# EAGLE design dnc (EAGLE 7.1.0)
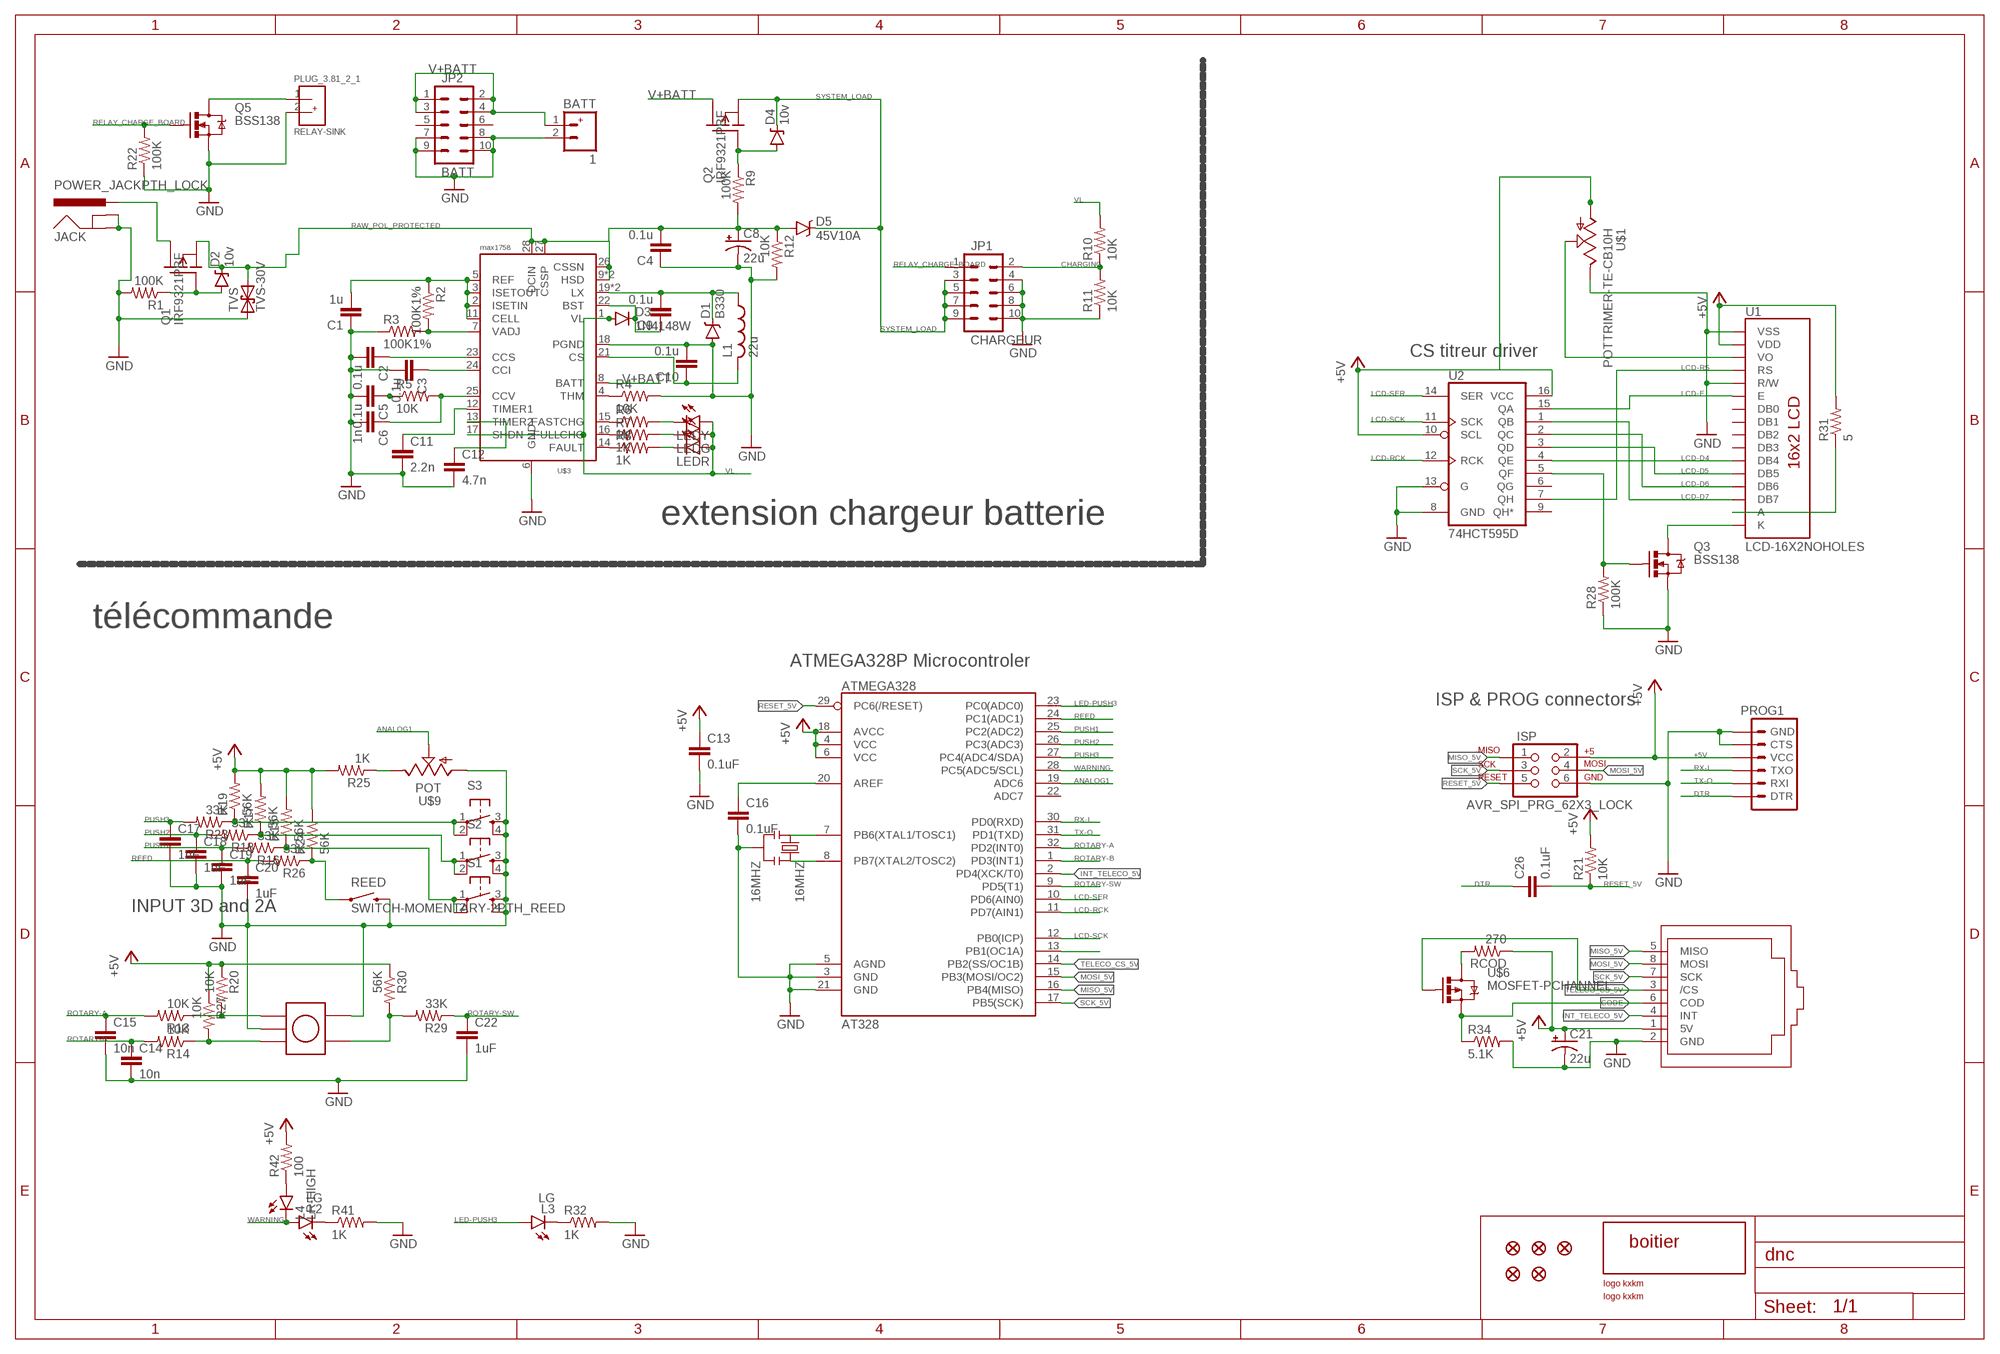
[diagram p0: schematic, sheet 1]

## Parts
1  BATT  DNC_IN2PWR  [DNC_IN2_PWR]
16MHZ  16MHZ  RESONATOR16MHZ  [RESONATOR-SMD]
AT328  ATMEGA328  ATMEGA168  [TQFP32-08]
C1  1u  CAP0603-CAP  [0603-CAP]
C2  0.1u  CAP0603-CAP  [0603-CAP]
C3  0.1u  CAP0603-CAP  [0603-CAP]
C4  0.1u  CAP0603-CAP  [0603-CAP]
C5  0.1u  CAP0603-CAP  [0603-CAP]
C6  1n  CAP0603-CAP  [0603-CAP]
C8  22u  CAP_POLC  [PANASONIC_C]
C9  0.1u  CAP0603-CAP  [0603-CAP]
C10  0.1u  CAP0603-CAP  [0603-CAP]
C11  2.2n  CAP0603-CAP  [0603-CAP]
C12  4.7n  CAP0603-CAP  [0603-CAP]
C13  0.1uF  C-EUC0603  [C0603]
C14  10n  C-EUC0603  [C0603]
C15  10n  C-EUC0603  [C0603]
C16  0.1uF  C-EUC0603  [C0603]
C17  1uF  C-EUC0603  [C0603]
C18  1uF  C-EUC0603  [C0603]
C19  1uF  C-EUC0603  [C0603]
C20  1uF  C-EUC0603  [C0603]
C21  22u  CAP_POL1206  [EIA3216]
C22  1uF  C-EUC0603  [C0603]
C26  0.1uF  C-EUC0603  [C0603]
D1  B330  DIODE-SCHOTTKY-MBRA140  [SMA-DIODE]
D2  10v  DIODE-ZENERSOD-123  [SOD-123]
D3  1N4148W  DIODESOD123  [SOD-123]
D4  10v  DIODE-ZENERSOD-123  [SOD-123]
D5  45V10A  DIODE_SCHOTKY  [DPAK]
ISP  AVR_SPI_PRG_62X3_LOCK  [2X3_LOCK]
JACK  POWER_JACKPTH_LOCK  [POWER_JACK_PTH_LOCK]
JP1  CHARGEUR  M05X2  [2X5_LOCK]
JP2  BATT  M05X2RA  [2X5-RA]
JP3  FIDUCIAL1X2.5  [FIDUCIAL-1X2.5]
JP4  FIDUCIAL1X2.5  [FIDUCIAL-1X2.5]
JP13  FIDUCIAL1X2.5  [FIDUCIAL-1X2.5]
JP14  FIDUCIAL1X2.5  [FIDUCIAL-1X2.5]
JP19  FIDUCIAL1X2.5  [FIDUCIAL-1X2.5]
L1  22u  L_BOURNS  [SRN1060]
L2  LG  LED1206  [LED-1206]
L3  LG  LED1206  [LED-1206]
L4  LR-HIGH  LED1206  [LED-1206]
LEDG  LED1206  [LED-1206]
LEDR  LED1206  [LED-1206]
LEDY  LED1206  [LED-1206]
PLUG_3.81_2_1  RELAY-SINK  M02PLUG  [PLUG_02]
PROG1  ARDUINO_SERIAL_PROGRAMLOCK  [1X06_LOCK]
Q1  IRF9321PBF  [SO-8]
Q2  IRF9321PBF  [SO-8]
Q3  BSS138  MOSFET-NCHANNELBSS138  [SOT23-3]
Q5  BSS138  MOSFET-NCHANNELBSS138  [SOT23-3]
R1  100K  RESISTOR0603-RES  [0603-RES]
R2  100K1%  RESISTOR0603-RES  [0603-RES]
R3  100K1%  RESISTOR0603-RES  [0603-RES]
R4  10K  RESISTOR0603-RES  [0603-RES]
R5  10K  RESISTOR0603-RES  [0603-RES]
R6  1K  RESISTOR0603-RES  [0603-RES]
R7  1K  RESISTOR0603-RES  [0603-RES]
R8  1K  RESISTOR0603-RES  [0603-RES]
R9  100K  RESISTOR0603-RES  [0603-RES]
R10  10K  RESISTOR0603-RES  [0603-RES]
R11  10K  RESISTOR0603-RES  [0603-RES]
R12  10K  RESISTOR0603-RES  [0603-RES]
R13  10K  RESISTOR0603-RES  [0603-RES]
R14  10K  RESISTOR0603-RES  [0603-RES]
R15  56K  RESISTOR0603-RES  [0603-RES]
R16  33K  RESISTOR0603-RES  [0603-RES]
R17  56K  RESISTOR0603-RES  [0603-RES]
R18  33K  RESISTOR0603-RES  [0603-RES]
R19  56K  RESISTOR0603-RES  [0603-RES]
R20  10K  RESISTOR0603-RES  [0603-RES]
R21  10K  RESISTOR0603-RES  [0603-RES]
R22  100K  RESISTOR0603-RES  [0603-RES]
R23  33K  RESISTOR0603-RES  [0603-RES]
R24  56K  RESISTOR0603-RES  [0603-RES]
R25  1K  RESISTOR0603-RES  [0603-RES]
R26  33K  RESISTOR0603-RES  [0603-RES]
R27  10K  RESISTOR0603-RES  [0603-RES]
R28  100K  RESISTOR0603-RES  [0603-RES]
R29  33K  RESISTOR0603-RES  [0603-RES]
R30  56K  RESISTOR0603-RES  [0603-RES]
R31  5  RESISTOR0805-RES  [0805]
R32  1K  RESISTOR0603-RES  [0603-RES]
R34  5.1K  RESISTOR0603-RES  [0603-RES]
R41  1K  RESISTOR0603-RES  [0603-RES]
R42  100  RESISTOR0603-RES  [0603-RES]
RCOD  270  RESISTOR0603-RES  [0603-RES]
REED  SWITCH-MOMENTARY-2PTH_REED  [REED_SWITCH_PTH]
S1  TAC_SWITCHPTH  [TACTILE-PTH]
S2  TAC_SWITCHPTH  [TACTILE-PTH]
S3  TAC_SWITCHPTH  [TACTILE-PTH]
TVS  TVS-30V  TVS  [SMA-DIODE]
U1  LCD-16X2NOHOLES  [LCD-16X2_NOHOLES]
U2  74HCT595D  [SO16]
U$1  POTTRIMER-TE-CB10H  [TRIMER-TE]
U$2  LOGOSIZE2  [KXKMLOGO2]
U$3  MAX1758  [SSOP28]
U$5  BOITIERBOITIER_FARNELLE_479-0020-0  [BOX_SIZE]
U$6  MOSFET-PCHANNEL  [SOT23-3]
U$6MOV  LOGOSIZE2  [KXKMLOGO2]
U$7  ROTARYEC12D1564404  [ROTARY_ALPS_EC12]
U$8  RJ45-EXTDNC  [RJ45-TRAFO]
U$9  POT  [POT_ALPS]

## Nets
+5V [5V]: AT328.4(VCC) AT328.6(VCC) AT328.18(AVCC) C13.1 C21.A(+) ISP.2 PROG1.4(VCC) R15.2 R17.2 R19.2 R20.1 R21.2 R24.2 R25.2 R27.1 R30.1 R31.2 R42.2 RCOD.1 U1.2(VDD) U2.10(SCL) U2.16(VCC) U$1.1(A) U$8.1(5V)
ANALOG1: AT328.19(ADC6) U$9.2(S)
AREF: AT328.20(AREF) C16.1
CHARGING: JP1.2 R10.1 R11.2
CODE: R34.1 U$6.2(S) U$8.6(COD)
DTR: C26.1 PROG1.1(DTR)
GND [GND]: 1.2(-) 16MHZ.2 AT328.3(GND) AT328.5(AGND) AT328.21(GND) C1.1 C2.2 C3.2 C4.1 C5.2 C6.2 C8.- C10.2 C11.2 C12.2 C13.2 C14.2 C15.2 C16.2 C17.2 C18.2 C19.2 C20.2 C21.C(-) C22.2 D1.A ISP.6 JACK.GND JACK.GNDBREAK JP1.4 JP1.6 JP1.8 JP1.10 JP2.7 JP2.8 JP2.9 JP2.10 PLUG_3.81_2_1.2 PROG1.5(CTS) PROG1.6(GND) Q3.2(S) Q5.2(S) R1.2 R3.1 R4.2 R11.1 R12.2 R22.1 R28.1 R32.2 R34.2 R41.2 REED.P$2 S1.3 S1.4 S2.3 S2.4 S3.3 S3.4 TVS.A U1.1(VSS) U1.5(R/W) U2.8(GND) U2.13(G) U$1.3(E) U$3.6(GND) U$3.18(PGND) U$7.C(COM) U$7.D(SW1) U$8.2(GND) U$9.1(A)
INT_TELECO_5V: AT328.2(PD4(XCK/T0)) U$8.4(INT)
LCD-D4: U1.11(DB4) U2.4(QE)
LCD-D5: U1.12(DB5) U2.3(QD)
LCD-D6: U1.13(DB6) U2.2(QC)
LCD-D7: U1.14(DB7) U2.1(QB)
LCD-E: U1.6(E) U2.15(QA)
LCD-LED-CONTROL: Q3.1(G) R28.2 U2.5(QF)
LCD-RCK: AT328.11(PD7(AIN1)) U2.12(RCK)
LCD-RS: U1.4(RS) U2.7(QH)
LCD-SCK: AT328.12(PB0(ICP)) U2.11(SCK)
LCD-SER: AT328.10(PD6(AIN0)) U2.14(SER)
LED-PUSH3: AT328.23(PC0(ADC0)) L3.A
MISO_5V: AT328.16(PB4(MISO)) ISP.1 U$8.5(MISO)
MOSI_5V: AT328.15(PB3(MOSI/OC2)) ISP.4 U$8.8(MOSI)
N$1: C1.2 R2.1 U$3.2(ISETIN) U$3.3(ISETOUT) U$3.5(REF) U$3.11(CELL)
N$3: C9.2 D1.C L1.P$1 U$3.19(LX) U$3.20(LX)
N$4: R2.2 R3.2 U$3.7(VADJ)
N$5: R4.1 U$3.4(THM)
N$6: C5.1 R5.1
N$7: C2.1 U$3.23(CCS)
N$8: C3.1 U$3.24(CCI)
N$9: C6.1 R5.2 U$3.25(CCV)
N$10: R6.1 U$3.15(FASTCHG)
N$11: R7.1 U$3.16(FULLCHG)
N$12: R8.1 U$3.14(FAULT)
N$13: LEDY.C R6.2
N$14: LEDG.C R7.2
N$15: LEDR.C R8.2
N$16: C11.1 U$3.12(TIMER1)
N$17: C9.1 D3.C U$3.22(BST)
N$18: C10.1 L1.P$2 U$3.21(CS)
N$19: PLUG_3.81_2_1.1 Q5.3(D)
N$20: D4.A Q2.4(G) R9.1
N$21: C12.1 U$3.13(TIMER2)
N$22: R15.1 R16.1 S1.1 S1.2
N$23: R14.1 R27.2 U$7.A
N$24: R17.1 R18.1 S2.1 S2.2
N$25: R13.1 R20.2 U$7.B
N$26: R19.1 R23.1 S3.1 S3.2
N$27: R25.1 U$9.3(E)
N$28: R24.1 R26.1 REED.P$1
N$29: L4.A R42.1
N$30: L2.C R41.1
N$31: R29.2 R30.2 U$7.E(SW2)
N$32: R31.1 U1.15(A)
N$33: U1.3(VO) U$1.2(S)
N$34: Q3.3(D) U1.16(K)
N$35: L3.C R32.1
N$36: RCOD.2 U$6.3(D)
N$38: AT328.13(PB1(OC1A))
N$43: 16MHZ.1 AT328.7(PB6(XTAL1/TOSC1))
N$44: 16MHZ.3 AT328.8(PB7(XTAL2/TOSC2))
PROTECT_GATE: D2.A Q1.4(G) R1.1
PUSH1: AT328.25(PC2(ADC2)) C19.1 R16.2
PUSH2: AT328.26(PC3(ADC3)) C18.1 R18.2
PUSH3: AT328.27(PC4(ADC4/SDA)) C17.1 R23.2
RAW_POL_PROTECTED [5V]: C4.2 C8.+ D2.C D5.1(A) D5.3(A) Q1.1(S) Q1.2(S) Q1.3(S) R9.2 R12.1 TVS.C U$3.9(HSD) U$3.10(HSD) U$3.26(CSSN) U$3.27(CSSP) U$3.28(DCIN)
RAW_UNPROTECTED1 [5V]: JACK.PWR Q1.5(D) Q1.6(D) Q1.7(D) Q1.8(D)
REED: AT328.24(PC1(ADC1)) C20.1 R26.2
RELAY_CHARGE_BOARD: JP1.1 Q5.1(G) R22.2
RESET_5V: AT328.29(PC6(/RESET)) C26.2 ISP.5 R21.1
ROTARY-A: AT328.32(PD2(INT0)) C15.1 R13.2
ROTARY-B: AT328.1(PD3(INT1)) C14.1 R14.2
ROTARY-SW: AT328.9(PD5(T1)) C22.1 R29.1
RX-I: AT328.30(PD0(RXD)) PROG1.3(TXO)
SCK_5V: AT328.17(PB5(SCK)) ISP.3 U$8.7(SCK)
SYSTEM_LOAD [5V]: D4.C D5.4(C) JP1.3 JP1.5 JP1.7 JP1.9 Q2.1(S) Q2.2(S) Q2.3(S)
TELECO_CS_5V: AT328.14(PB2(SS/OC1B)) U$6.1(G) U$8.3(/CS)
TX-O: AT328.31(PD1(TXD)) PROG1.2(RXI)
V+BATT: 1.1(+) JP2.1 JP2.2 JP2.3 JP2.4 Q2.5(D) Q2.6(D) Q2.7(D) Q2.8(D) U$3.8(BATT)
VL: D3.A LEDG.A LEDR.A LEDY.A R10.2 U$3.1(VL) U$3.17(SHDN)
WARNING: AT328.28(PC5(ADC5/SCL)) L2.A L4.C
Unconnected: AT328.22(ADC7) JP2.5 JP2.6 U1.7(DB0) U1.8(DB1) U1.9(DB2) U1.10(DB3) U2.6(QG) U2.9(QH*)

## Notes on the sheet
- CS titreur driver
- extension chargeur batterie
- télécommande
- ATMEGA328P Microcontroler
- ISP & PROG connectors
- INPUT 3D and 2A

## Library data of the parts
1 = pierre_vv:DNC_IN2; C: 1
16MHZ = SparkFun-FreqCtrl:RESONATOR: Resonator Small SMD resonator. Used, eg, on the Arduino Pro/ Pro Mini boards. 8MHz- XTAL-08895 16MHz- XTAL-08900; PROD_ID: XTAL-08900
AT328 = SparkFun:ATMEGA168
C1-C3 C5 C6 C11 C12 = SparkFun-Passives:CAP: Capacitor Standard 0603 ceramic capacitor, and 0.1" leaded capacitor.; C: 1
C4 C9 C10 = SparkFun-Passives:CAP: Capacitor Standard 0603 ceramic capacitor, and 0.1" leaded capacitor.; C: 1; VMIN: 35V
C8 = SparkFun-Passives:CAP_POL: Capacitor Polarized These are standard SMD and PTH capacitors. Normally 10uF, 47uF, and 100uF in electrolytic and tantalum varieties. Always verify the external diameter of the through hole cap, it varies with capacity, voltage, and manufacturer. The EIA devices should be standard.; C: 1; VMIN: 35V
C13-C20 C22 C26 = rcl:C-EU: CAPACITOR, European symbol
C21 = SparkFun-Passives:CAP_POL: Capacitor Polarized These are standard SMD and PTH capacitors. Normally 10uF, 47uF, and 100uF in electrolytic and tantalum varieties. Always verify the external diameter of the through hole cap, it varies with capacity, voltage, and manufacturer. The EIA devices should be standard.
D1 = SparkFun-DiscreteSemi:DIODE-SCHOTTKY: Schottky diodes in SFE's production catalog BAT20J 1A 23V 0.62Vf RB751 120mA 40V 0.37Vf PMEG4005EJ 0.5A 40V 0.42Vf MBRA140 1A 40V 0.5Vf B340A 3A 40V SMA; C: 1; PROD_ID: DIO-08053; VALUE: MBRA140
D2 D4 = SparkFun-DiscreteSemi:DIODE-ZENER: Zener Diode Production Part - 8199 3.4V Zener Voltage; C: 1
D3 = SparkFun-DiscreteSemi:DIODE: Diode These are standard reverse protection diodes and small signal diodes. SMA package can handle up to about 1A. SOD-323 can handle about 200mA. What the SOD-323 package when ordering, there are some mfgs out there that are 5-pin packages.; C: 1
D5 = pierre_vv:DIODE_SCHOTKY; C: 1
ISP = SparkFun:AVR_SPI_PRG_6: AVR ISP 6 Pin This is the reduced ISP connector for AVR programming. Common on Arduino. This footprint will take up less PCB space and can be used with a 10-pin to 6-pin adapter such as SKU: BOB-08508
JACK = SparkFun:POWER_JACK: Power Jack This is the standard 5.5mm barrel jack for power. The PTH is the most common, proven, reliable, footprint. All others are experimental. The Slot footprint only works if the mill layer is transmitted to the PCB fab house so be warned. Spark Fun Electronics SKU : PRT-00119. Mating wall wart : TOL-00298 (and others)
JP1 = pierre_vv:M05X2; C: 1
JP2 = SparkFun-Connectors:M05X2: Header 5x2 Standard 10-pin dual row 0.1" header. Commonly used with AVR-ISP. Use with Spark Fun Electronics SKU: PRT-00778; C: 1
JP3 JP4 JP13 JP14 JP19 = SparkFun:FIDUCIAL: Fiducial Alignment Points Various fiducial points for machine vision alignment.
L1 = pierre_vv:L_BOURNS; C: 1
L2-L4 = SparkFun-LED:LED: LEDs Standard schematic elements and footprints for 5mm, 3mm, 1206, and 0603 sized LEDs. 5mm - Spark Fun Electronics SKU : COM-00529 (and others)
LEDG LEDR LEDY = SparkFun-LED:LED: LEDs Standard schematic elements and footprints for 5mm, 3mm, 1206, and 0603 sized LEDs. 5mm - Spark Fun Electronics SKU : COM-00529 (and others); C: 1
PLUG_3.81_2_1 = pierre_vv:M02; C: 1
PROG1 = SparkFun:ARDUINO_SERIAL_PROGRAM
Q1 Q2 = pierre_vv:IRF9321PBF; C: 1; OC_FARNELL: 1831075
Q3 = SparkFun-DiscreteSemi:MOSFET-NCHANNEL: Common NMOSFET Parts MFG P/N Store ID Prod ID FDD8780 TRANS-09984 SI7820DN TRANS-11055 FDS6630A IC-08089 2N7002PW TRANS-11151 FQP30N06L COM-10213 TRANS-10060 BSS123LT1G TRANS-08345 BSS138 TRANS-00830 BS170 2N7000; PROD_ID: TRANS-00830
Q5 = SparkFun-DiscreteSemi:MOSFET-NCHANNEL: Common NMOSFET Parts MFG P/N Store ID Prod ID FDD8780 TRANS-09984 SI7820DN TRANS-11055 FDS6630A IC-08089 2N7002PW TRANS-11151 FQP30N06L COM-10213 TRANS-10060 BSS123LT1G TRANS-08345 BSS138 TRANS-00830 BS170 2N7000; C: 1; PROD_ID: TRANS-00830
R1-R12 R22 = SparkFun-Passives:RESISTOR: Resistor Basic schematic elements and footprints for 0603, 1206, and PTH resistors.; C: 1
R13-R21 R23-R30 R32 R34 R41 R42 RCOD = SparkFun-Passives:RESISTOR: Resistor Basic schematic elements and footprints for 0603, 1206, and PTH resistors.
R31 = SparkFun-Passives:RESISTOR: Resistor Basic schematic elements and footprints for 0603, 1206, and PTH resistors.; P: 250mw
REED = SparkFun-Electromechanical:SWITCH-MOMENTARY-2: Various NO switches- pushbuttons, reed, etc
S1-S3 = SparkFun:TAC_SWITCH: Momentary Switch Button commonly used for reset or general input. Spark Fun Electronics SKU : COM-00097
TVS = SparkFun:TVS; C: 1
U1 = SparkFun-Displays:LCD-16X2: Standard text-only 16x2 parallel input LCD
U2 = IC:74*595: 8-bit SHIFT REGISTER, output latch
U$1 U$9 = pierre_vv:POT
U$2 U$6MOV = pierre_vv:LOGO
U$3 = pierre_vv:MAX1758; C: 1
U$5 = pierre_vv:BOITIER
U$6 = SparkFun-DiscreteSemi:MOSFET-PCHANNEL: Generic PMOSFET IRLML2244 - TRANS-11153 (SOT-23 -20V -4.3A) (1.Gate 2.Source 3.Drain) FQP27P06 - COM-10349 <http://www.sparkfun.com/products/10349> (TO-220 -60V -27A) (1.Gate 2.Source 3.Drain); PROD_ID: TRANS-08285
U$7 = pierre_vv:ROTARY
U$8 = con-amphenol-rj45-ld:RJ45-EXTDNC: dnc

## Net classes
0 default: width 0.203 mm
1 GND: width 0.254 mm
2 3.3V: width 0.406 mm
3 5V: width 0.305 mm
4 230AC: width 0.61 mm, clearance 0.305 mm

## Board
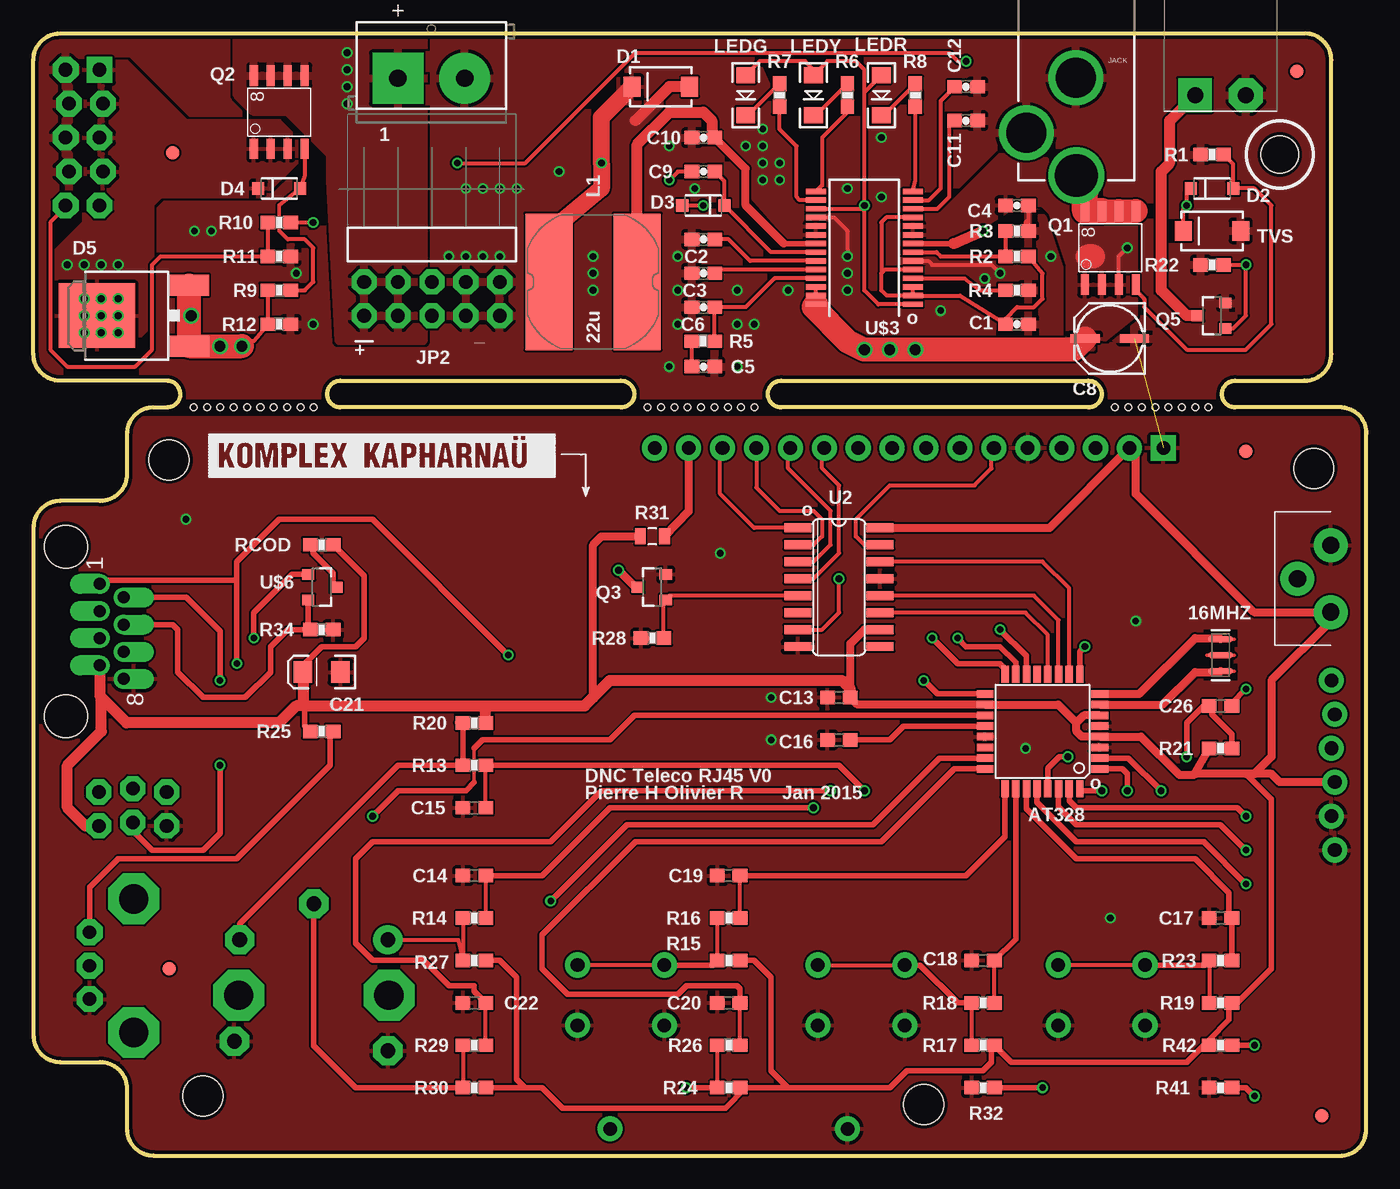
[diagram p1: board, top side]
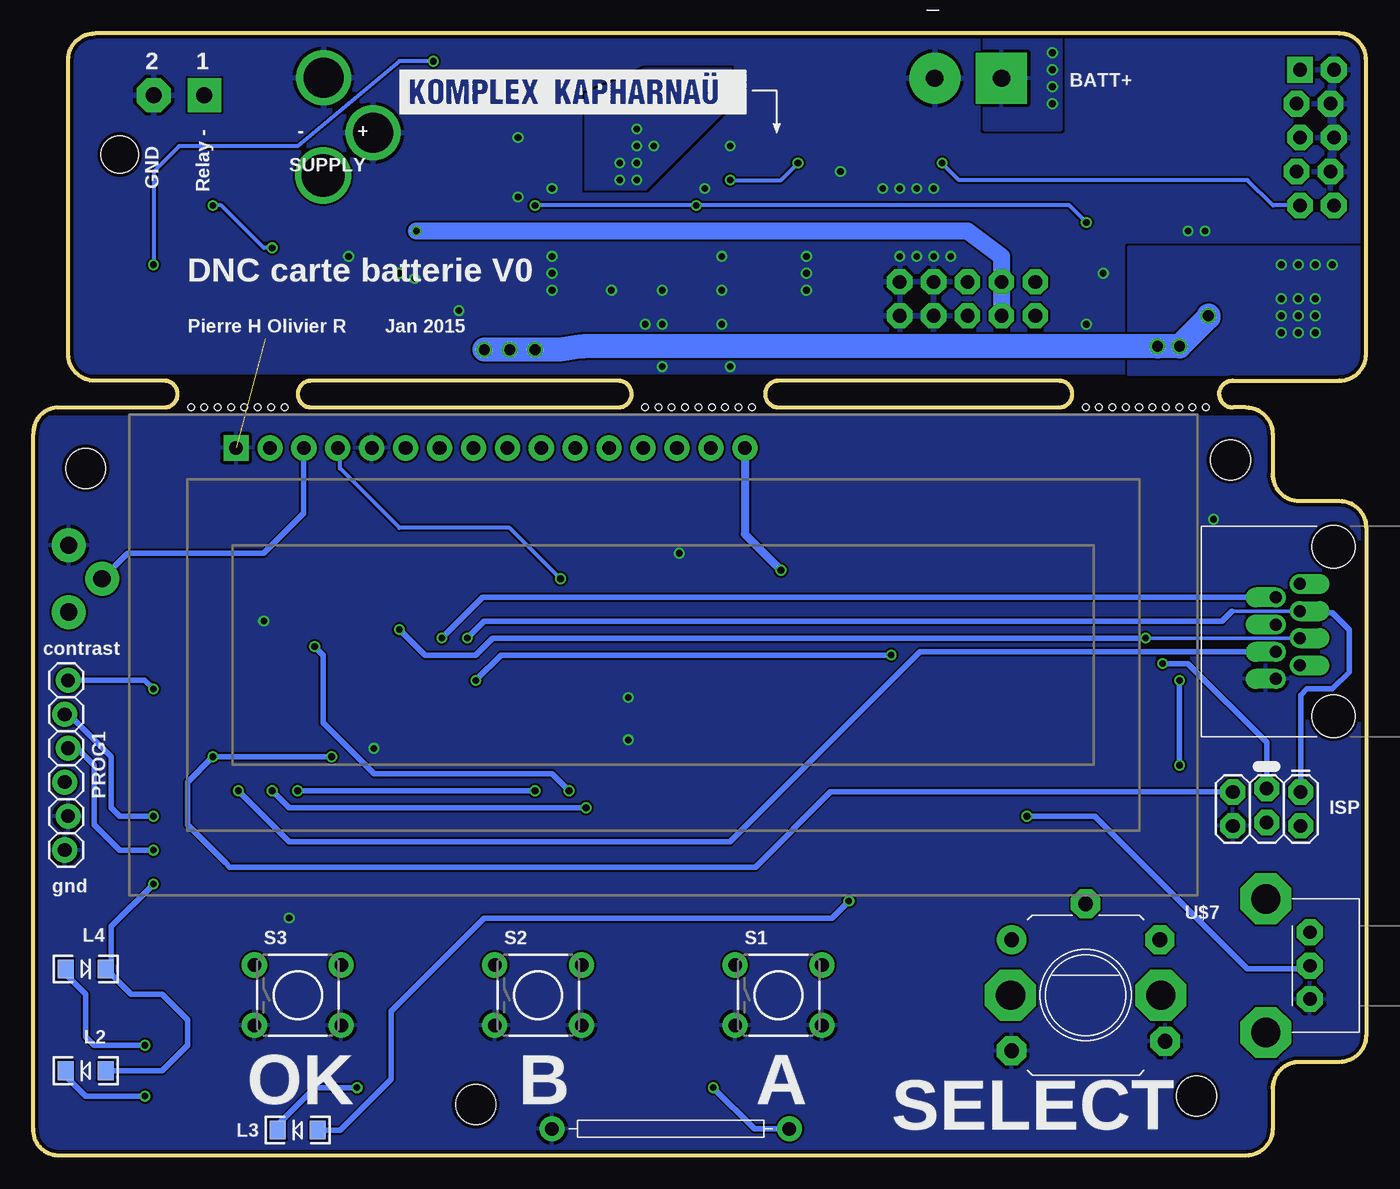
[diagram p2: board, bottom side, seen from below]

Size 99.8 x 84 mm. Coordinates in mm from the lower left corner, seen from the top.
Outline: 10,56 arc90 11,57 arc90 10,58 2,58 arc-90 0,60 0,82 arc-90 2,84 95.2,84 arc-90 97.2,82 97.2,60 arc-90 95.2,58 90,58 arc90 89,57 arc90 90,56
Outline: 22,57 arc-90 23,58 44,58 arc-90 45,57 arc-90 44,56 23,56 arc-90 22,57
Outline: 79,56 56,56 arc-90 55,57 arc-90 56,58 79,58 arc-90 80,57 arc-90 79,56
Copper layers (1*16): Top 0.035mm / dielectric 1.5mm / Bottom 0.035mm
Design rules "SeeedStudio_2layer_DRU_no_angle_20140221 *": minimum track width 6mil, minimum drill 12mil, track to track 6mil, track to pad 6mil, pad to pad 6mil, via to via 6mil, smd to smd 0mil, copper to edge 10mil, drill to drill 10mil, minimum pad ring 12mil, minimum via ring 6mil, stop-mask expansion 2mil, vias tented up to drill 100mil, thermal gap 10mil
Holes 2.8 mm at 93.34,74.93
Holes 0.5 mm at 21,56 20,56 19,56 18,56 17,56 16,56 15,56 14,56 13,56 12,56 54,56 53,56 52,56 51,56 50,56 49,56 48,56 47,56 46,56 88,56 87,56 86,56 85,56 84,56 83,56 82,56 81,56
Holes 3 mm at 12.7,4.45 95.89,51.44 66.67,3.81 10.16,52.07

### Footprints (pad centres in the part's own frame; a part is rotated, then mirrored left to right if it is on the bottom)
DNC_IN2_PWR = drill 1.3 pad 3.81 square: 1 0,0 | drill 1.3 pad 3.81: 2 5,0
RESONATOR-SMD = smd 0.45 x 1.905: 1 -1.2,0; 2 0,0; 3 1.2,0
TQFP32-08 = smd 1.27 x 0.559: 1 -4.293,2.8; 2 -4.293,2; 3 -4.293,1.2; 4 -4.293,0.4; 5 -4.293,-0.4; 6 -4.293,-1.2; 7 -4.293,-2; 8 -4.293,-2.8; 17 4.293,-2.8; 18 4.293,-2; 19 4.293,-1.2; 20 4.293,-0.4; 21 4.293,0.4; 22 4.293,1.2; 23 4.293,2; 24 4.293,2.8 | smd 0.559 x 1.27: 9 -2.8,-4.293; 10 -2,-4.293; 11 -1.2,-4.293; 12 -0.4,-4.293; 13 0.4,-4.293; 14 1.2,-4.293; 15 2,-4.293; 16 2.8,-4.293; 25 2.8,4.293; 26 2,4.293; 27 1.2,4.293; 28 0.4,4.293; 29 -0.4,4.293; 30 -1.2,4.293; 31 -2,4.293; 32 -2.8,4.293
0603-CAP = smd 1.1 x 1: 1 -0.85,0; 2 0.85,0
PANASONIC_C = smd 2.2 x 0.65: + 1.9,-0.2; - -1.8,-0.2
C0603 = smd 1.1 x 1: 1 -0.85,0; 2 0.85,0
EIA3216 = smd 1.4 x 1.6: A 1.4,0; C -1.4,0
SMA-DIODE = smd 1.27 x 1.47: A -2.15,0; C 2.15,0
SOD-123 = smd 0.9 x 0.95: A 1.575,0; C -1.575,0
DPAK = smd 1.6 x 3: 1 -2.28,-5.31; 3 2.28,-5.31 | smd 4.826 x 5.715: 4 0,1.588
2X3_LOCK = drill 1.016 pad 1.88 octagon: 1 0,0; 2 0,2.54; 3 2.54,-0.254; 4 2.54,2.286; 5 5.08,0; 6 5.08,2.54
POWER_JACK_PTH_LOCK = drill 2.997 pad 4.115: GND 0.025,6.557; GNDBREAK 3.762,10.7 | drill 3.2 pad 4.115: PWR 0,13.878
2X5_LOCK = drill 1.016 pad 1.93 octagon: 1 -5.08,-1.143; 2 -5.08,1.397; 3 -2.54,-1.397; 4 -2.54,1.143; 5 0,-1.143; 6 0,1.397; 7 2.54,-1.397; 8 2.54,1.143; 10 5.08,1.397 | drill 1.016 pad 1.93 square: 9 5.08,-1.143
2X5-RA = drill 1.016 pad 1.88 octagon: 1 -1.27,5.08; 2 1.27,5.08; 3 -1.27,2.54; 4 1.27,2.54; 5 -1.27,0; 6 1.27,0; 7 -1.27,-2.54; 8 1.27,-2.54; 9 -1.27,-5.08; 10 1.27,-5.08
FIDUCIAL-1X2.5 = smd 1 x 1: 1 0,0
SRN1060 = smd 3.505 x 10.211: P$1 3.302,0; P$2 -3.302,0
LED-1206 = smd 1.2 x 1.4: A -1.5,0; C 1.5,0
PLUG_02 = drill 1.2 pad 2.54 square: 1 -1.905,0 | drill 1.2 pad 2.54 octagon: 2 1.905,0
1X06_LOCK = drill 1.016 pad 1.88: 1 0,0; 2 2.54,-0.254; 3 5.08,0; 4 7.62,-0.254; 5 10.16,0; 6 12.7,-0.254
SO-8 = smd 1.524 x 0.61: 1 -2.743,1.905; 2 -2.743,0.635; 3 -2.743,-0.635; 4 -2.743,-1.905; 5 2.743,-1.905; 6 2.743,-0.635; 7 2.743,0.635; 8 2.743,1.905
SOT23-3 = smd 0.8 x 0.9: 1 -0.95,-1; 2 0.95,-1; 3 0,1.1
0603-RES = smd 1.1 x 1: 1 -0.85,0; 2 0.85,0
0805 = smd 0.8 x 1.2: 1 -0.9,0; 2 0.9,0
REED_SWITCH_PTH = drill 1.016 pad 1.88: P$1 -8.89,0; P$2 8.89,0
TACTILE-PTH = drill 1.016 pad 1.88: 1 -3.251,2.261; 2 3.251,2.261; 3 -3.251,-2.261; 4 3.251,-2.261
LCD-16X2_NOHOLES = drill 1.016 pad 1.88 square: 1 -32,15.5 | drill 1.016 pad 1.88: 2 -29.46,15.5; 3 -26.92,15.5; 4 -24.38,15.5; 5 -21.84,15.5; 6 -19.3,15.5; 7 -16.76,15.5; 8 -14.22,15.5; 9 -11.68,15.5; 10 -9.14,15.5; 11 -6.6,15.5; 12 -4.06,15.5; 13 -1.52,15.5; 14 1.02,15.5; 15 3.56,15.5; 16 6.1,15.5
SO16 = smd 0.66 x 2.032: 1 -4.445,-3.073; 2 -3.175,-3.073; 3 -1.905,-3.073; 4 -0.635,-3.073; 5 0.635,-3.073; 6 1.905,-3.073; 7 3.175,-3.073; 8 4.445,-3.073; 9 4.445,3.073; 10 3.175,3.073; 11 1.905,3.073; 12 0.635,3.073; 13 -0.635,3.073; 14 -1.905,3.073; 15 -3.175,3.073; 16 -4.445,3.073
TRIMER-TE = drill 1.3 pad 2.54: 1 -2.5,0; 2 0,2.5; 3 2.5,0
SSOP28 = smd 0.4 x 1.5: 1 -4.225,-3.625; 2 -3.575,-3.625; 3 -2.925,-3.625; 4 -2.275,-3.625; 5 -1.625,-3.625; 6 -0.975,-3.625; 7 -0.325,-3.625; 8 0.325,-3.625; 9 0.975,-3.625; 10 1.625,-3.625; 11 2.275,-3.625; 12 2.925,-3.625; 13 3.575,-3.625; 14 4.225,-3.625; 15 4.225,3.625; 16 3.575,3.625; 17 2.925,3.625; 18 2.275,3.625; 19 1.625,3.625; 20 0.975,3.625; 21 0.325,3.625; 22 -0.325,3.625; 23 -0.975,3.625; 24 -1.625,3.625; 25 -2.275,3.625; 26 -2.925,3.625; 27 -3.575,3.625; 28 -4.225,3.625
ROTARY_ALPS_EC12 = drill 1.1 pad 2.184: A -5.55,4.15 | drill 1.1 pad 2.184 octagon: B 5.55,4.15; C -5.55,-4.15; D 5.95,-3.45; E 0,6.85 | drill 2.2 pad 3.81 octagon: P$1 -5.625,0; P$2 5.625,0
RJ45-TRAFO = drill 0.9 offset: 1 -2.54,2.54; 2 -3.556,4.318; 3 -0.508,2.54; 4 -1.524,4.318; 5 1.524,2.54; 6 0.508,4.318; 7 3.556,2.54; 8 2.54,4.318 | hole 3.2: -6.35,0; 6.35,0
POT_ALPS = drill 1 pad 1.93 octagon: 1 3.3,-2.5; 2 3.3,0; 3 3.3,2.5 | drill 2.2 pad 3.81 octagon: P$1 0,5; P$2 0,-5

### Placement (x,y rotation side)
1  27.3,80.64 0 top
16MHZ  88.9,37.47 90 top
AT328  75.56,31.75 180 top
C1  73.66,62.23 180 top
C2  50.16,68.58 180 top
C3  50.16,66.04 180 top
C4  73.66,71.12 180 top
C5  50.16,59.05 0 top
C6  50.16,63.5 180 top
C8  80.64,60.96 180 top
C9  50.16,73.66 180 top
C10  50.16,76.2 180 top
C11  69.85,77.47 0 top
C12  69.85,80.01 0 top
C13  60.33,34.29 180 top
C14  33.02,20.95 180 top
C15  33.02,26.04 180 top
C16  60.33,31.11 180 top
C17  88.9,17.78 180 top
C18  71.12,14.61 180 top
C19  52.07,20.95 180 top
C20  52.07,11.43 180 top
C21  21.59,36.2 180 top
C22  33.02,11.43 180 top
C26  88.9,33.66 180 top
D1  46.99,80.01 180 top
D2  88.27,72.39 0 top
D3  50.16,71.12 180 top
D4  18.41,72.39 0 top
D5  6.35,62.87 90 top
ISP  4.91,27.21 180 bottom
JACK  78.11,87.25 180 top
JP1  3.81,76.2 90 top
JP2  29.84,64.14 90 top
JP3  10.16,13.97 0 top
JP4  90.81,52.7 0 top
JP13  10.41,75.06 0 top
JP14  94.61,81.15 180 top
JP19  96.47,2.96 0 top
L1  41.91,65.41 180 top
L2  95.89,6.35 180 bottom
L3  80.01,1.91 180 bottom
L4  95.89,13.97 0 bottom
LEDG  53.34,79.38 270 top
LEDR  63.5,79.38 270 top
LEDY  58.42,79.38 270 top
PLUG_3.81_2_1  88.9,79.38 0 top
PROG1  97.2,35.57 270 bottom
Q1  80.64,67.94 90 top
Q2  18.41,78.11 90 top
Q3  46.35,42.55 90 top
Q5  88.27,62.87 90 top
R1  88.27,74.93 180 top
R2  73.66,67.31 180 top
R3  73.66,69.22 180 top
R4  73.66,64.77 0 top
R5  50.16,60.96 0 top
R6  60.96,79.38 90 top
R7  55.88,79.38 90 top
R8  66.04,79.38 90 top
R9  18.41,64.77 180 top
R10  18.41,69.85 0 top
R11  18.41,67.31 180 top
R12  18.41,62.23 0 top
R13  33.02,29.21 0 top
R14  33.02,17.78 0 top
R15  52.07,14.61 0 top
R16  52.07,17.78 0 top
R17  71.12,8.26 0 top
R18  71.12,11.43 0 top
R19  88.9,11.43 0 top
R20  33.02,32.38 180 top
R21  88.9,30.48 180 top
R22  88.27,66.67 0 top
R23  88.9,14.61 0 top
R24  52.07,5.08 0 top
R25  21.59,31.75 180 top
R26  52.07,8.26 0 top
R27  33.02,14.61 180 top
R28  46.35,38.73 0 top
R29  33.02,8.26 180 top
R30  33.02,5.08 180 top
R31  46.35,46.35 180 top
R32  71.12,5.08 180 top
R34  21.59,39.37 0 top
R41  88.9,5.08 180 top
R42  88.9,8.26 180 top
RCOD  21.59,45.72 180 top
REED  52.08,2 180 bottom
S1  44,12 0 bottom
S2  62,12 0 bottom
S3  80,12 0 bottom
TVS  88.27,69.22 180 top
U1  52.62,37.47 0 bottom
U2  60.33,42.55 270 top
U$1  97.16,43.18 90 top
U$2  72.39,74.3 0 bottom
U$3  62.23,67.94 90 top
U$5  0,0 0 top
U$6  21.59,42.55 270 top
U$6MOV  13.11,47.07 0 top
U$7  21,12 0 bottom
U$8  2.44,39.23 90 bottom
U$9  7.51,14.21 0 bottom

### Tracks (layer width: path | path; a pad name or v marks a point on that pad's centre or on a via)
+5V
  Top 0.406: 90.81,28.57 92.71,26.67 92.71,13.97 90.17,11.43 R19.2 89.53,11.21 89.53,10.16 88.05,8.68 R42.2 87.63,8.26 86.36,6.99 73.24,6.99 R17.2 71.75,8.04 71.75,6.99 71.12,6.35 65.41,6.35 64.14,5.08 56.52,5.08 | 53.34,5.08 56.52,5.08 | R15.2 53.98,14.61 55.24,13.34 55.24,6.35 56.52,5.08 | R30.1 36.83,5.08 | 36.83,5.08 38.1,5.08 39.62,3.56 51.82,3.56 53.34,5.08 | 53.34,5.08 R24.2 | R27.1 34.92,14.61 36.2,13.34 36.2,5.71 36.83,5.08 | R31.2 45.09,46.35 | 20.32,33.66 20.32,32.17 R25.2 | C21.A 20.19,36.7 21.59,38.1 24.13,38.1 24.77,38.73 24.77,43.4 RCOD.1
  Top 0.61: U2.10 62.23,39.37 61.17,38.31 61.17,34.92 C13.1 61.72,33.75 AT328.18 76.74,33.75 78.11,32.38 | 78.11,32.38 78.11,31.75 78.5,31.35 AT328.4 82.95,31.35 85.83,28.47 86.89,28.47 | AT328.6 78.67,32.95 78.11,32.38 | 86.89,28.47 R21.2 | PROG1.4 93.33,27.95 92.71,28.57 91.44,28.57 | 91.44,28.57 90.81,28.57 87,28.57 86.89,28.47 | U2.16 76.11,46.99 U1.2 82.55,52.5 82.55,49.53 91.4,40.68 U$1.1 97.16,40.01 92.71,35.56 92.71,29.84 91.44,28.57 | 41.91,34.29 41.91,45.72 42.55,46.35 R31.2
  Top 0.813: U$8.1 4.98,34.39 5.08,34.29 | 20.32,33.66 33.66,33.66 | 33.66,33.66 41.27,33.66 41.91,34.29 43.18,35.56 60.54,35.56 61.17,34.92 | R20.1 33.87,33.44 33.66,33.66 | C21.A 20.19,33.78 20.32,33.66 | ISP.2 3.9,24.68 2.54,26.04 2.54,29.21 5.08,31.75 5.08,34.29 | 20.32,33.66 19.68,33.66 18.41,32.38 6.99,32.38 5.08,34.29
ANALOG1  (via drill 0.5)
  Top 0.254: 33.02,30.48 33.02,27.94
  Top 0.406: AT328.19 45.02,32.95 43.18,31.11 33.66,31.11 33.02,30.48 | 33.02,27.94 32.38,27.3 27.3,27.3 v25.4,25.4
  Bottom 0.406: v25.4,25.4 20.32,25.4 8.89,13.97 3.97,13.97 | 3.81,13.97 3.97,13.97 | 3.97,13.97 U$9.2
AREF
  Top 0.406: AT328.20 65.17,32.15 64.14,31.11 C16.1
CHARGING
  Top 0.305: R10.1 R11.2 9.53,67.31 8.89,66.67 8.89,60.33 7.62,59.05 2.54,59.05 1.27,60.33 1.27,69.85 2.41,70.99 JP1.2
CODE
  Top 0.406: U$6.2 20.59,39.52 R34.1 19.05,39.37 17.78,38.1 17.78,36.2 15.88,34.29 12.7,34.29 10.79,36.2 10.79,39.37 10.42,39.74 U$8.6
DTR  (via drill 0.5)
  Top 0.406: C26.1 89.75,33.87 v90.81,34.92
  Bottom 0.406: PROG1.1 91.45,35.57 v90.81,34.92
GND  (via drill 0.5)  (1 unrouted)
  Top 0.305: U$3.18 59.95,70.22 60.96,69.22 v60.96,67.31 | U$3.6 67.02,66.97 67.31,66.67 71.75,66.67 v72.39,66.04 | C4.1 R3.1 | R3.1 74.51,70.06 74.3,69.85 74.3,69 R3.1
  Top 0.813: D1.A 47.62,80.01 45.09,77.47
  other vias: 48.26,67.31 13.34,69.22 20.95,62.23 41.91,67.31 41.91,66.04 41.91,64.77 76.2,67.31 63.5,71.75 39.37,73.66 60.96,72.39 63.5,76.2 47.62,75.56 60.96,64.77 56.52,64.77 19.68,66.04 60.96,66.04 12.06,69.22 52.7,64.77 49.53,72.39 55.24,31.11 55.24,34.29 51.44,45.09 74.3,30.48 82.55,40.01 80.64,17.78 11.43,47.62 67.94,63.25 71.25,65.66 32.38,72.39 33.66,72.39 34.92,72.39 36.2,72.39 31.11,67.31 32.38,67.31 33.66,67.31 34.92,67.31 52.7,62.23 53.98,62.23 47.62,59.05 52.7,59.05 48.26,64.77 48.26,62.23
  pour Bottom (rank 3): -2.54,88.27 99.69,88.27 100.33,58.66 -1.91,58.66
  pour Top (rank 4): -3.81,90.17 101.6,90.17 101.6,56.88 -3.81,56.88
  pour Top: -1.91,55.24 100.97,55.24 100.97,-5.08 -1.91,-5.08
  pour Bottom: -3.81,55.24 102.87,55.24 102.87,-3.81 -3.81,-3.81
INT_TELECO_5V  (via drill 0.5)
  Top 0.406: AT328.2 82.01,29.75 v84.45,27.3
  Bottom 0.406: U$8.4 33.41,37.71 47.62,23.5 80.64,23.5 v84.45,27.3
LCD-D4
  Top 0.305: U2.4 58.42,43.18 60.33,45.09 60.33,50.16 59.05,51.44 59.05,52.8 U1.11
LCD-D5
  Top 0.305: U2.3 58.42,44.45 59.69,45.72 59.69,48.26 56.52,51.44 56.52,52.8 U1.12
LCD-D6
  Top 0.305: U1.13 54.15,49.99 55.88,48.26 58.42,48.26 59.05,47.62 59.05,46.35 58.42,45.72 U2.2
LCD-D7
  Top 0.305: U2.1 53.98,46.99 51.44,49.53 51.44,52.8 U1.14
LCD-E
  Top 0.305: U2.15 62.23,45.72 61.59,46.35 61.59,47.62 64.14,50.16 70.48,50.16 71.75,51.44 71.75,52.8 U1.6
LCD-LED-CONTROL
  Top 0.305: R28.2 47.2,41.45 Q3.1 47.67,41.91 U2.5
LCD-RCK
  Top 0.305: AT328.11 76.77,40.08 74.93,41.91 U2.12
LCD-RS  (via drill 0.5)
  Top 0.305: U2.7 59.05,39.37 60.33,40.64 v60.33,43.18
  Bottom 0.305: v60.33,43.18 64.14,46.99 72.39,46.99 76.83,51.44 76.83,52.8 U1.4
LCD-SCK
  Top 0.305: AT328.12 75.97,38.97 74.3,40.64 U2.11
LCD-SER
  Top 0.305: AT328.10 77.56,42.45 75.56,44.45 U2.14
LED-PUSH3  (via drill 0.5)
  Top 0.406: AT328.23 67.85,29.75 62.87,24.77 44.45,24.77 v38.73,19.05
  Bottom 0.406: v38.73,19.05 40.01,17.78 66.04,17.78 73.03,10.79 73.03,5.71 76.83,1.91 L3.A
MISO_5V  (via drill 0.5)
  Top 0.406: AT328.16 72.77,36.45 72.39,36.83 69.22,36.83 v67.31,38.73
  Bottom 0.254: U$8.5 10.04,40.76
  Bottom 0.406: 10.04,40.76 10.79,40.01 66.04,40.01 v67.31,38.73 | ISP.1 4.91,34.47 4.45,34.92 2.54,34.92 1.27,36.2 1.27,39.37 2.54,40.64 4.86,40.64 U$8.5
MOSI_5V  (via drill 0.5)
  Top 0.406: AT328.15 73.56,36.92 72.39,38.1 69.85,38.1 v69.22,38.73 | v13.97,35.56 13.97,39.23 11.43,41.77 U$8.8 | ISP.4 7.45,24.3 8.89,22.86 12.7,22.86 13.97,24.13 v13.97,29.21
  Bottom 0.406: U$8.8 66.17,41.77 v69.22,38.73 | v13.97,35.56 v13.97,29.21
N$1
  Top 0.305: U$3.2 69.4,64.37 C1.2 72.81,62.65 73.66,63.5 74.93,63.5 75.56,64.14 75.56,66.04 R2.1 | U$3.2 63.9,64.37 63.5,64.77 63.5,66.04 | U$3.5 63.78,66.32 63.5,66.04 | U$3.11 63.87,70.22 63.5,69.85 63.5,66.04 | U$3.2 U$3.3
N$3  (via drill 0.5)
  Top 0.305: C9.2 48.26,73.66 v47.62,73.03
  Top 1.27: L1.P$1 38.86,67.44 38.73,67.56 38.73,69.22 42.55,72.39 v42.55,74.3 42.55,77.72 D1.C
  Bottom 0.305: v47.62,73.03 43.81,73.03 v42.55,74.3
  other vias: 55.88,73.03 54.61,73.03 54.61,74.3 55.88,74.3 54.61,76.83 54.61,75.56 53.34,75.56
  pour Top: 43.81,82.55 53.98,82.55 56.52,76.83 59.05,67.94 57.15,67.94 47.62,78.74 43.81,78.74
  pour Bottom: 47.62,81.28 53.98,81.28 58.42,79.38 58.42,72.39 53.98,72.39 47.62,78.74
N$4
  Top 0.305: U$3.7 67.64,67.62 67.94,67.31 72.39,67.31 73.12,67.62 R2.2 R3.2
N$5
  Top 0.305: U$3.4 67.05,65.67 69.72,65.66 70.89,64.78 R4.1
N$6
  Top 0.305: C5.1 R5.1
N$7
  Top 0.305: U$3.23 53.68,66.97 52.07,68.58 C2.1
N$8
  Top 0.305: U$3.24 51.3,66.32 C3.1
N$9
  Top 0.305: R5.2 C6.1 53.34,63.5 55.51,65.67 U$3.25
N$10
  Top 0.305: R6.1 60.96,78.11 59.05,76.2 59.05,72.62 U$3.15
N$11
  Top 0.305: U$3.16 57.38,71.52 57.15,71.75 57.15,75.56 55.88,76.83 R7.1
N$12
  Top 0.305: U$3.14 65.86,72.2 66.04,73.03 R8.1
N$13
  Top 0.305: LEDY.C 58.61,77.88 R6.2
N$14
  Top 0.305: LEDG.C 53.53,77.88 R7.2
N$15
  Top 0.305: LEDR.C 63.69,77.88 R8.2
N$16
  Top 0.305: U$3.12 67.69,70.87 68.58,71.75 68.58,77.05 C11.1
N$17
  Top 0.305: U$3.22 55.24,67.62 D3.C 51.74,72.94 C9.1
N$18
  Top 0.406: U$3.21 56.19,68.27
  Top 0.61: 56.19,68.27 53.34,71.12 53.34,73.88 C10.1
  Top 0.813: L1.P$2 45.21,75.69 47.62,78.11 50.16,78.11 50.8,77.47 50.8,76.42 C10.1
N$19
  Top 0.813: Q5.3 86.36,62.87 84.45,64.77 84.45,73.66 85.09,74.3 85.09,77.47 PLUG_3.81_2_1.1
N$20
  Top 0.254: 18.41,69.22 18.41,69.85 18.41,71.12
  Top 0.305: Q2.4 20.32,73.36 D4.A 18.41,71.12 | R9.1 20.32,64.77 20.95,65.41 20.95,67.94 20.32,68.58 19.05,68.58 18.41,69.22
N$21
  Top 0.305: U$3.13 67.08,71.52 67.94,72.39 67.94,78.95 C12.1
N$22
  Top 0.305: S1.1 S1.2 | R15.1 R16.1
  Top 0.406: S1.1 50.88,14.26 R15.1
N$23
  Top 0.305: R14.1 R27.2 31.81,16.15 U$7.A
N$24
  Top 0.305: S2.2 S2.1 | R17.1 R18.1
  Top 0.406: S2.1 66.38,14.26 69.22,11.43 R18.1
N$25
  Top 0.406: 31.75,32.38 R20.2 R13.1 27.3,29.21 15.45,17.36 U$7.B
N$26
  Top 0.305: S3.1 S3.2 | R23.1 R19.1
  Top 0.406: S3.1 87.71,14.26 R23.1
N$27
  Top 0.406: U$9.3 4.21,20.09 6.35,22.23 15.24,22.23 22.23,29.21 22.23,31.54 R25.1
N$28  (via drill 0.5)
  Top 0.305: R24.1 R26.1
  Top 0.406: v48.9,5.08 R24.1
  Bottom 0.406: REED.P$1 45.81,2 v48.9,5.08
N$29  (via drill 0.5)
  Top 0.406: R42.1 v91.44,8.26
  Bottom 0.406: L4.A 97.39,13.56 95.89,12.06 95.89,8.89 95.25,8.26 v91.44,8.26
N$30  (via drill 0.5)
  Top 0.406: R41.1 90.81,5.08 v91.44,4.45
  Bottom 0.406: L2.C 97.39,5.95 95.89,4.45 v91.44,4.45
N$31
  Top 0.305: R29.2 R30.2 | U$7.E 21,18.37
  Top 0.406: 21,18.37 21,8.21 24.13,5.08 R30.2
N$32
  Top 0.61: U1.15 49.06,48.22 R31.1
N$33
  Bottom 0.406: U1.3 79.55,48.09 82.55,45.09 92.75,45.09 U$1.2
N$34  (via drill 0.5)
  Top 0.61: Q3.3 45.09,42.55 v43.81,43.81
  Bottom 0.61: U1.16 46.52,46.52 v43.81,43.81
N$35  (via drill 0.5)
  Top 0.406: R32.1 v75.56,5.08
  Bottom 0.406: L3.C 81.51,2.31 78.74,5.08 v75.56,5.08
N$36
  Top 0.406: U$6.3 22.44,42.8 22.44,43.6 20.95,45.09 20.95,45.51 RCOD.2
N$37
  cutout Top: 87.63,36.83 90.17,36.83 90.17,35.56 87.63,35.56
N$39
  cutout Top: 87.63,38.1 87.63,39.37 90.17,39.37 90.17,38.1
N$43
  Top 0.61: AT328.7 84.55,33.75 87,36.2 88.83,36.2 16MHZ.1
N$44
  Top 0.61: AT328.8 82.81,34.55 87,38.73 88.83,38.73 16MHZ.3
PROTECT_GATE
  Top 0.305: Q1.4 82.55,64.77 83.19,64.14 83.19,63.5 86.36,60.33 90.81,60.33 92.71,62.23 92.71,71.12 91.44,72.39 D2.A 89.84,74.2 R1.1
PUSH1
  Top 0.305: R16.2 C19.1
  Top 0.406: C19.1 69.85,20.95 72.77,23.87 AT328.25
PUSH2
  Top 0.305: R18.2 C18.1
  Top 0.406: AT328.26 73.56,16.2 C18.1
PUSH3
  Top 0.406: AT328.27 74.36,25.96 78.11,22.23 87,22.23 89.53,19.68 89.53,18 C17.1 R23.2
RAW_POL_PROTECTED  (via drill 0.5, 0.8)
  Top 0.305: R9.2 R12.1 16.51,60.96 16,60.96 v15.62,60.58 | U$3.26 U$3.27 U$3.28 | TVS.C 86.11,70.88 v86.36,71.12 86.36,72.06 D2.C | Q1.3 81.28,67.31 v81.92,67.94
  Top 0.61: v15.62,60.58 v15.62,60.59
  Top 1.778: D5.3 D5.1 v15.62,60.59 | U$3.28 58.42,63.53 60.96,60.96 v62.23,60.33 v64.14,60.33 v66.04,60.33 77.91,60.33 C8.+ | 79.38,67.31 78.94,67.31
  Bottom 0.305: v81.92,67.94 82.55,67.94 85.72,71.12 v86.36,71.12
  Bottom 1.778: v11.81,62.87 11.81,62.74 v13.97,60.58 v15.62,60.58 58.67,60.58 60.33,60.33 v66.04,60.33
  pour Top: 65.41,70.48 67.94,70.48 72.39,74.93 75.56,74.93 78.74,71.75 81.28,71.75 82.55,71.12 82.55,62.87 79.38,60.33 77.47,60.33 77.47,66.67 76.2,70.48 75.56,71.12 73.66,71.12 68.58,67.94 65.41,67.94
RAW_UNPROTECTED1
  Top 1.778: Q1.5 Q1.6 Q1.7
  Top 1.93: Q1.7 Q1.8 78.74,72.1 JACK.PWR
REED
  Top 0.305: R26.2 C20.1
  Top 0.406: C20.1 52.92,12.48 52.7,12.7 48.9,12.7 48.26,12.06 40.01,12.06 38.1,13.97 38.1,16.51 45.09,23.5 63.5,23.5 68.95,28.95 AT328.24
RELAY_CHARGE_BOARD  (via drill 0.5)
  Top 0.305: v31.75,74.3 36.83,74.3 45.09,82.55 68.58,82.55 69.22,81.92 v69.85,81.92 | Q5.1 89.86,61.91 90.81,62.87 v90.81,66.67 R22.2
  Bottom 0.305: JP1.1 6.99,71.12 8.89,73.03 30.48,73.03 v31.75,74.3 | v69.85,81.92 72.39,81.92 80.01,75.56 88.9,75.56 90.81,73.66 v90.81,66.67
RESET_5V  (via drill 0.5)
  Top 0.406: AT328.29 75.97,28.98 76.83,29.84 v77.47,29.84 | v86.36,29.84 86.36,32.38 87.63,33.66 C26.2 88.27,33.44 88.27,33.02 89.75,31.54 R21.1
  Bottom 0.406: ISP.5 40.09,27.21 45.72,21.59 85.09,21.59 85.41,21.91 88.27,24.77 88.27,27.94 v86.36,29.84 v77.47,29.84
ROTARY-A  (via drill 0.5)
  Top 0.305: C15.1 R13.2
  Top 0.406: R13.2 60.33,29.21 v62.23,27.3 | v80.01,27.3 78.52,27.3 AT328.32
  Bottom 0.406: v62.23,27.3 v80.01,27.3
ROTARY-B  (via drill 0.5)
  Top 0.305: C14.1 R14.2
  Top 0.406: C14.1 38.1,20.95 43.18,26.04 v58.42,26.04 | AT328.1 81.54,28.95 81.92,28.57 v81.92,27.3
  Bottom 0.406: v58.42,26.04 80.64,26.04 v81.92,27.3
ROTARY-SW  (via drill 0.5)
  Top 0.305: R29.1 C22.1
  Top 0.406: v59.69,27.3 42.55,27.3 38.73,23.5 25.4,23.5 24.13,22.23 24.13,15.88 25.4,14.61 29.21,14.61 31.11,12.7 33.02,12.7 33.02,12.28 C22.1 | AT328.9 78.36,37.73 v78.74,38.1
  Bottom 0.406: v59.69,27.3 60.96,28.57 74.3,28.57 78.11,32.38 78.11,37.47 v78.74,38.1
RX-I  (via drill 0.5)
  Top 0.406: AT328.30 76.77,26.11 78.11,24.77 88.9,24.77 v90.81,22.86
  Bottom 0.406: PROG1.3 96.53,30.49 95.25,29.21 95.25,24.77 93.34,22.86 v90.81,22.86
SCK_5V  (via drill 0.5)
  Top 0.406: 15.24,43.08 4.98,43.08 U$8.7 | v35.56,37.47 25.4,47.62 18.41,47.62 15.24,44.45 15.24,43.08 | AT328.17 67.69,34.55 v66.67,35.56 | v15.24,36.83 15.24,43.08
  Bottom 0.406: v35.56,37.47 64.77,37.47 v66.67,35.56 | ISP.3 7.45,30.94 13.34,36.83 v15.24,36.83
SYSTEM_LOAD  (via drill 0.5)
  Top 0.61: D5.4 v5.08,62.87
  other vias: 3.81,64.14 5.08,64.14 6.35,64.14 6.35,62.87 3.81,62.87 3.81,61.59 5.08,61.59 6.35,61.59 2.54,66.67 3.81,66.67 5.08,66.67 6.35,66.67
  pour Bottom: -2.54,67.94 17.78,67.94 17.78,58.52 -2.54,58.52
  pour Top: 3.81,81.92 6.99,81.92 11.43,77.47 18.41,77.47 19.68,76.2 19.68,74.3 17.14,71.75 9.53,71.75 8.89,71.12 8.89,62.23 6.99,60.33 2.54,60.33 1.27,61.59 1.27,67.31 3.81,69.85
TELECO_CS_5V  (via drill 0.5)
  Top 0.406: AT328.14 74.36,37.4 v72.39,39.37 | U$6.1 19.36,43.49 16.51,40.64 v16.51,38.73
  Bottom 0.254: U$8.3 v16.51,38.73
  Bottom 0.406: v16.51,38.73 65.41,38.73 66.67,37.47 70.48,37.47 v72.39,39.37
  Bottom 0.813: v16.51,38.73
TX-O  (via drill 0.5)
  Top 0.406: AT328.31 77.56,26.57 78.11,26.04 90.17,26.04 v90.81,25.4
  Bottom 0.406: PROG1.2 97.17,33.03 93.98,29.84 93.98,26.04 93.34,25.4 v90.81,25.4
V+BATT  (via drill 0.5)
  Top 0.406: U$3.8 68.91,68.27
  Top 0.813: 68.91,68.27 v71.12,69.22
  Bottom 1.27: v71.12,69.22 29.84,69.22 27.3,67.31 JP2.3
  other vias: 23.5,82.55 23.5,81.28 23.5,80.01 23.5,78.74
  pour Top: 15.24,84.84 29.21,84.84 29.21,60.96 22.86,60.96 22.23,73.03 22.23,74.93 19.05,78.11 16.51,78.11 15.24,79.38
  pour Bottom: 28.57,83.82 28.57,76.83 22.86,76.83 22.86,83.82
VL  (via drill 0.5)
  Top 0.305: R10.2 v20.95,69.85 | U$3.1 63.28,63.72 62.23,64.77 v62.23,71.12 | v62.23,71.12 62.23,79.61 | D3.A v50.16,71.12 | U$3.17 61.98,70.87 v62.23,71.12 | 62.23,79.61 LEDR.A | 62.23,79.61 62.23,81.28 61.59,81.92 59.46,81.92 LEDY.A 58.42,81.28 57.78,81.92 54.38,81.92 LEDG.A
  Bottom 0.305: v62.23,71.12 v50.16,71.12 22.23,71.12 v20.95,69.85
WARNING  (via drill 0.5)
  Top 0.406: AT328.28 75.17,26.43 78.11,23.5 87.63,23.5 v90.81,20.32
  Bottom 0.406: v90.81,20.32 93.98,17.14 93.98,14.38 L4.C 92.48,12.06 90.17,12.06 88.27,10.16 88.27,8.26 90.17,6.35 L2.A

### Text on the board
tPlace: o | _ | + | o | o
tNames: DNC Teleco RJ45 V0 | Pierre H Olivier R Jan 2015
bNames: BATT+ | Relay - | + | - | GND | SUPPLY | DNC carte batterie V0 | Pierre H Olivier R Jan 2015 | contrast | gnd | A | B | OK | SELECT
Document: RPI+ 10mm | RPI+ 10mm | RPI + 8mm